# Altium project mach_do_nhiet_do_do_an_1.PrjPcb
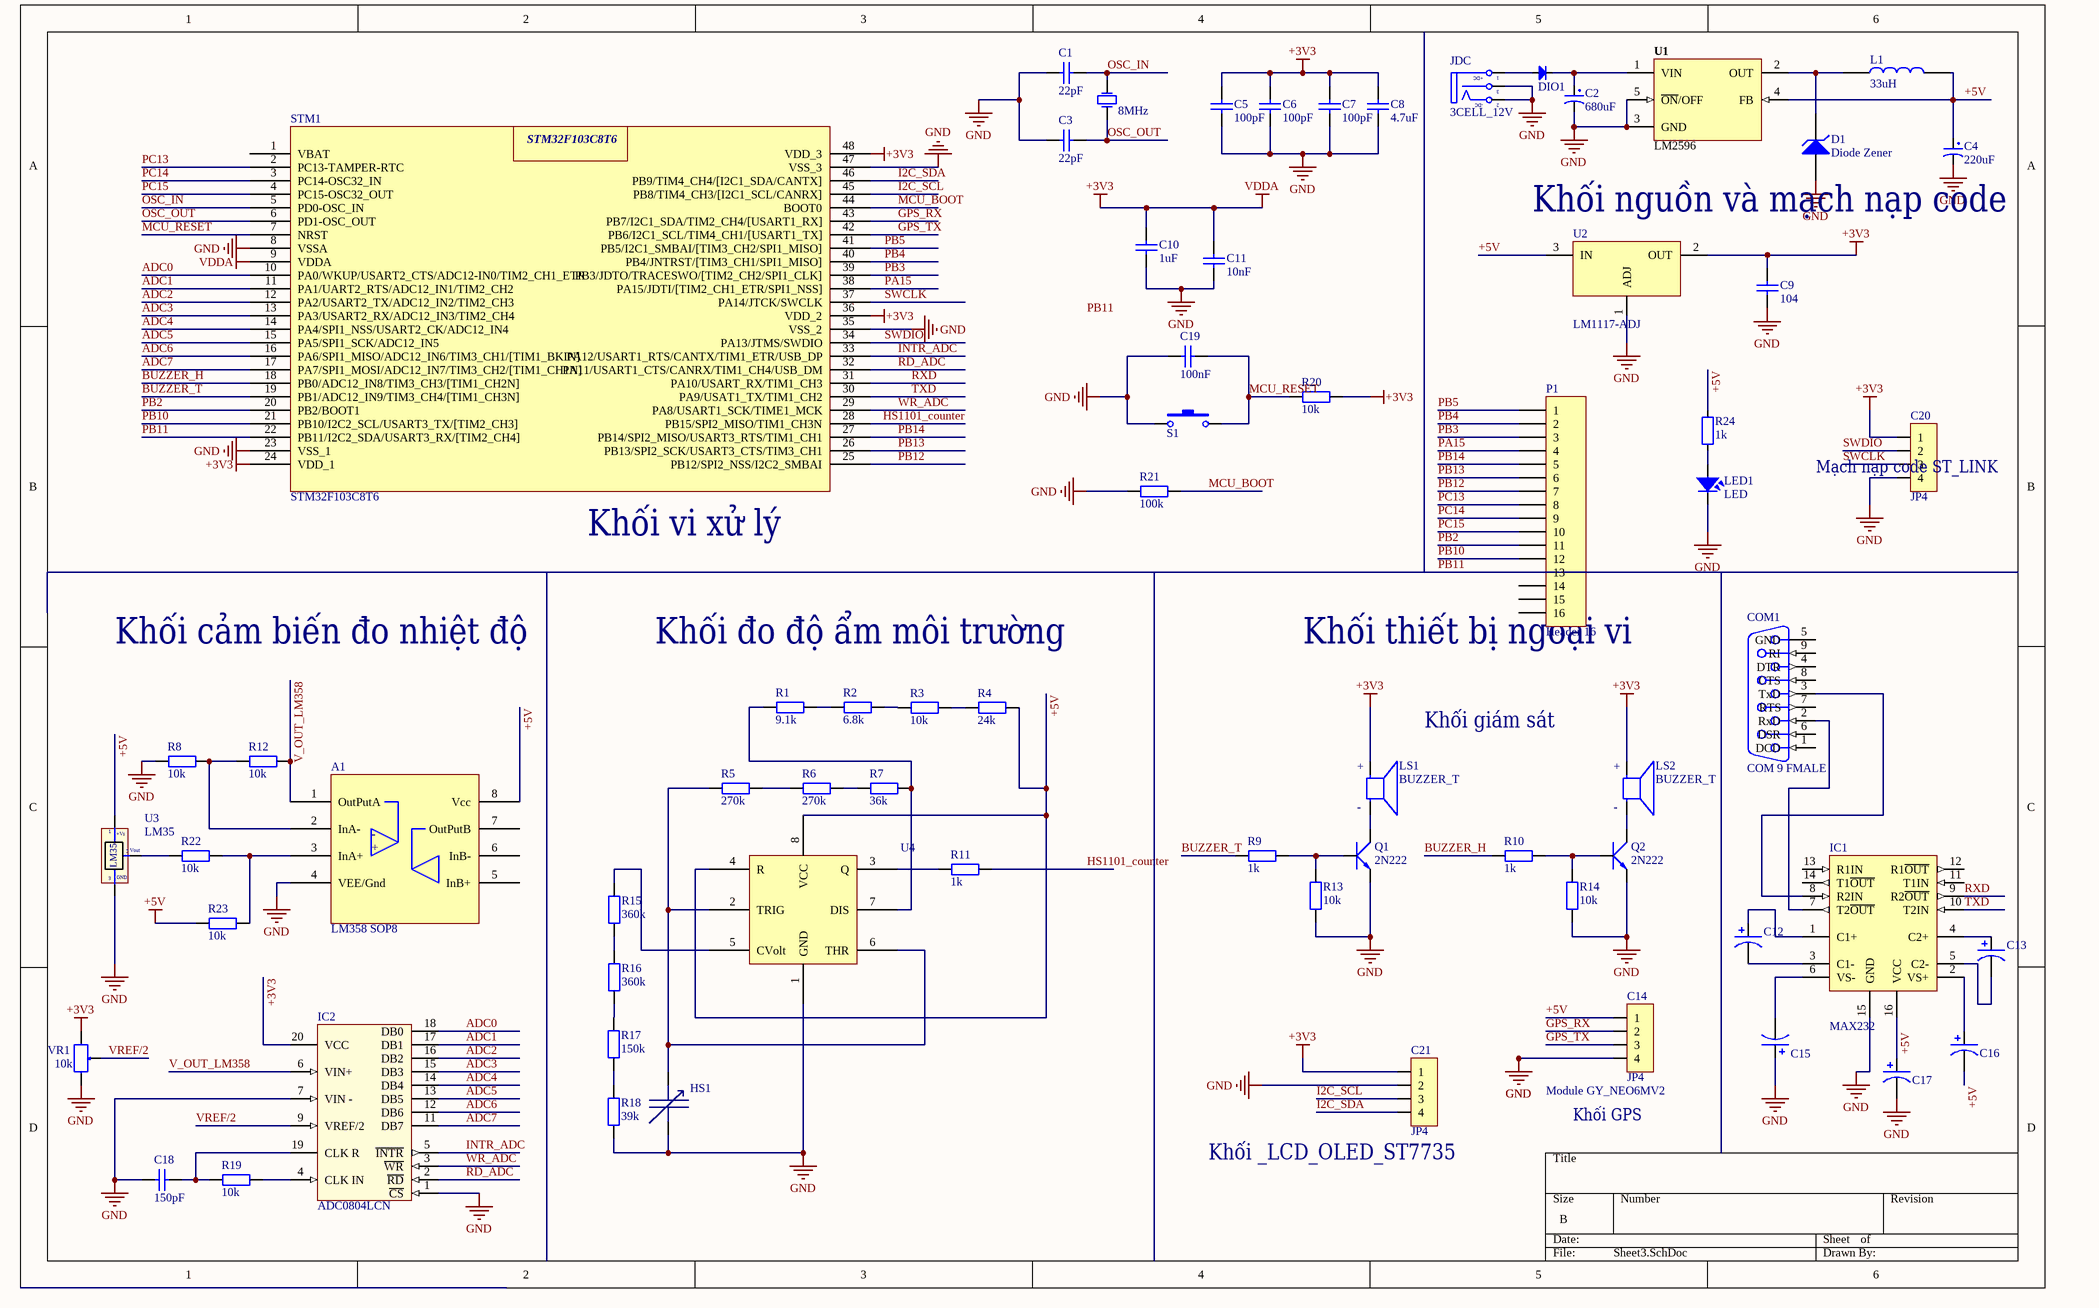
[diagram p0: Sheet3.SchDoc]
1 sheet, 68 parts. Net scope: global (net labels, ports and power ports of the same name join across sheets).
Board files: PCB1.PcbDoc, PCB2.PcbDoc

## Sheet Sheet3.SchDoc
size B

### Parts
A1  LM358 SOP8  [DIP8]
C1  22pF  [tu 0805]
C2  680uF  [tu hoa 13mm]
C3  22pF  [tu 0805]
C4  220uF  [Tu hoa 5mm]
C5  100pF  [Tu 0805]
C6  100pF  [Tu 0805]
C7  100pF  [Tu 0805]
C8  4.7uF  [Tu 0805]
C9  104  [tu 0805]
C10  1uF  [tu 0805]
C11  10nF  [tu 0805]
C12  10uF/50V  [C3MM]  (value not drawn)
C13  10uF/50V  [C3MM]  (value not drawn)
C14  JP4  [Header4]
C15  10uF/50V  [C3MM]  (value not drawn)
C16  10uF/50V  [C3MM]  (value not drawn)
C17  10uF/50V  [C3MM]  (value not drawn)
C18  150pF  [tu 0805]
C19  100nF  [tu 0805]
C20  JP4  [JP4-C1T]
C21  JP4  [Header4]
COM1  COM 9 FMALE  [COM9A]
D1  Diode Zener  [SMA]
DIO1  Diode SMD  [DIO-SMD-106]  (value not drawn)
HS1  C1815 SOT23 TRANS NPN 0.15A 50V (SMD-HF)  [Cam Bien HS1101]  (value not drawn)
IC1  MAX232  [DIP16/W0.3]
IC2  ADC0804LCN  [DIP20/W0.3]
JDC  3CELL_12V  [DC-IN]
L1  33uH  [Cuon Cam 7.5x7x5]
LED1  LED  [LED-0805-Red]
LS1  BUZZER_T  [XDCR_AI-1224-TWT-5V-R]
LS2  BUZZER_T  [XDCR_AI-1224-TWT-5V-R]
P1  Header 16  [HDR1X16]
Q1  2N222  [SOT23]
Q2  2N222  [SOT23]
R1  9.1k  [Tro SMD 0805]
R2  6.8k  [Tro SMD 0805]
R3  10k  [Tro SMD 0805]
R4  24k  [tro smd 0805]
R5  270k  [tro smd 0805]
R6  270k  [tro smd 0805]
R7  36k  [tro smd 0805]
R8  10k  [tro smd 0805]
R9  1k  [tro smd 0805]
R10  1k  [tro smd 0805]
R11  1k  [tro smd 0805]
R12  10k  [tro smd 0805]
R13  10k  [tro smd 0805]
R14  10k  [tro smd 0805]
R15  360k  [Tro SMD 0805]
R16  360k  [Tro SMD 0805]
R17  150k  [Tro SMD 0805]
R18  39k  [tro smd 0805]
R19  10k  [tro smd 0805]
R20  10k  [tro smd 0805]
R21  100k  [tro smd 0805]
R22  10k  [tro smd 0805]
R23  10k  [tro smd 0805]
R24  1k  [RES-SMD-0805]
S1  SW-SMD  [SW-SMD]  (value not drawn)
STM1  STM32F103C8T6  [QFP50P900X900X160-48N]
U1  LM2596  [TO263-5]
U2  LM1117-ADJ  [LM1117-SOP]
U3  LM35  [QTO-92]
U4  MH001514  [sop 8]  (value not drawn)
VR1  10k  [VAR_RESISTOR]
Y1  8MHz  [THACH ANH CAM]

### Nets
+3V3: C5.2 C6.2 C7.1 C8.1 C9.1 C10.1 C11.1 C20.1 C21.1 IC2.20(VCC) LS1.P LS2.P R20.1 STM1.9(VDDA) STM1.24(VDD_1) STM1.36(VDD_2) STM1.48(VDD_3) U2.2(OUT) VR1.1  [also labelled VDDA]
+5V: A1.8(Vcc) C4.1 C14.1 C16.2 C17.1 IC1.16(VCC) L1.2 R4.1 R23.1 R24.1 U1.4(FB) U2.3(IN) U3.1(+Vs) U4.4(R) U4.8(VCC)
GND: A1.4(VEE/Gnd) C1.2 C2.2 C3.2 C4.2 C5.1 C6.1 C7.2 C8.2 C9.2 C10.2 C11.2 C14.4 C15.1 C17.2 C18.2 C19.1 C20.4 C21.2 D1.1(A) HS1.1 IC1.15(GND) IC2.1(~{CS}) IC2.7(VIN_-) IC2.8(AGND) IC2.10(DGND) JDC.2(TN) JDC.3(S) LED1.2 Q1.1(E) Q2.1(E) R8.1 R13.1 R14.1 R18.1 R21.2 S1.1 STM1.8(VSSA) STM1.23(VSS_1) STM1.35(VSS_2) STM1.47(VSS_3) U1.3(GND) U1.5(~{ON}/OFF) U2.1(ADJ) U3.3(-) U4.1(GND) VR1.3
ADC0: IC2.18(DB0) STM1.10(PA0/WKUP/USART2_CTS/ADC12-IN0/TIM2_CH1_ETR)
ADC1: IC2.17(DB1) STM1.11(PA1/UART2_RTS/ADC12_IN1/TIM2_CH2)
ADC2: IC2.16(DB2) STM1.12(PA2/USART2_TX/ADC12_IN2/TIM2_CH3)
ADC3: IC2.15(DB3) STM1.13(PA3/USART2_RX/ADC12_IN3/TIM2_CH4)
ADC4: IC2.14(DB4) STM1.14(PA4/SPI1_NSS/USART2_CK/ADC12_IN4)
ADC5: IC2.13(DB5) STM1.15(PA5/SPI1_SCK/ADC12_IN5)
ADC6: IC2.12(DB6) STM1.16(PA6/SPI1_MISO/ADC12_IN6/TIM3_CH1/[TIM1_BKIN])
ADC7: IC2.11(DB7) STM1.17(PA7/SPI1_MOSI/ADC12_IN7/TIM3_CH2/[TIM1_CH1N])
BUZZER_H: R10.1 STM1.18(PB0/ADC12_IN8/TIM3_CH3/[TIM1_CH2N])
BUZZER_T: R9.1 STM1.19(PB1/ADC12_IN9/TIM3_CH4/[TIM1_CH3N])
GPS_RX: C14.2 STM1.43(PB7/I2C1_SDA/TIM2_CH4/[USART1_RX])
GPS_TX: C14.3 STM1.42(PB6/I2C1_SCL/TIM4_CH1/[USART1_TX])
HS1101_counter: R11.2 STM1.28(PB15/SPI2_MISO/TIM1_CH3N)
I2C_SCL: C21.3 STM1.45(PB8/TIM4_CH3/[I2C1_SCL/CANRX])
I2C_SDA: C21.4 STM1.46(PB9/TIM4_CH4/[I2C1_SDA/CANTX])
INTR_ADC: IC2.5(~{INTR}) STM1.33(PA12/USART1_RTS/CANTX/TIM1_ETR/USB_DP)
MCU_BOOT: R21.1 STM1.44(BOOT0)
MCU_RESET: C19.2 R20.2 S1.2 STM1.7(NRST)
OSC_IN: C1.1 STM1.5(PD0-OSC_IN) Y1.2(OSC2)
OSC_OUT: C3.1 STM1.6(PD1-OSC_OUT) Y1.1(OSC1)
PA15: P1.4 STM1.38(PA15/JDTI/[TIM2_CH1_ETR/SPI1_NSS])
PB2: P1.11 STM1.20(PB2/BOOT1)
PB3: P1.3 STM1.39(PB3/JDTO/TRACESWO/[TIM2_CH2/SPI1_CLK])
PB4: P1.2 STM1.40(PB4/JNTRST/[TIM3_CH1/SPI1_MISO])
PB5: P1.1 STM1.41(PB5/I2C1_SMBAI/[TIM3_CH2/SPI1_MISO])
PB10: P1.12 STM1.21(PB10/I2C2_SCL/USART3_TX/[TIM2_CH3])
PB11: P1.13 STM1.22(PB11/I2C2_SDA/USART3_RX/[TIM2_CH4])
PB12: P1.7 STM1.25(PB12/SPI2_NSS/I2C2_SMBAI)
PB13: P1.6 STM1.26(PB13/SPI2_SCK/USART3_CTS/TIM3_CH1)
PB14: P1.5 STM1.27(PB14/SPI2_MISO/USART3_RTS/TIM1_CH1)
PC13: P1.8 STM1.2(PC13-TAMPER-RTC)
PC14: P1.9 STM1.3(PC14-OSC32_IN)
PC15: P1.10 STM1.4(PC15-OSC32_OUT)
RD_ADC: IC2.2(~{RD}) STM1.32(PA11/USART1_CTS/CANRX/TIM1_CH4/USB_DM)
RXD: IC1.9(R2~{OUT}) STM1.31(PA10/USART_RX/TIM1_CH3)
SWCLK: C20.3 STM1.37(PA14/JTCK/SWCLK)
SWDIO: C20.2 STM1.34(PA13/JTMS/SWDIO)
TXD: IC1.10(T2IN) STM1.30(PA9/USAT1_TX/TIM1_CH2)
V_OUT_LM358: A1.1(OutPutA) IC2.6(VIN+) R12.2
VREF/2: IC2.9(VREF/2) VR1.2
WR_ADC: IC2.3(~{WR}) STM1.29(PA8/USART1_SCK/TIME1_MCK)
NetA1_2: A1.2(InA-) R8.2 R12.1
NetA1_3: A1.3(InA+) R22.2 R23.2
NetC2_1: C2.1 DIO1.2(K) U1.1(VIN)
NetC12_1: C12.1 IC1.1(C1+)
NetC12_2: C12.2 IC1.3(C1-)
NetC13_1: C13.1 IC1.4(C2+)
NetC13_2: C13.2 IC1.5(C2-)
NetC15_2: C15.2 IC1.6(VS-)
NetC16_1: C16.1 IC1.2(VS+)
NetC18_1: C18.1 IC2.19(CLK_R) R19.1
NetCOM1_2: COM1.2(RxD) IC1.7(T2~{OUT})
NetCOM1_3: COM1.3(TxD) IC1.8(R2IN)
NetD1_2: D1.2(K) L1.1 U1.2(OUT)
NetDIO1_1: DIO1.1(A) JDC.1(T)
NetHS1_2: HS1.2 R5.1 U4.2(TRIG) U4.6(THR)
NetIC2_4: IC2.4(CLK_IN) R19.2
NetLED1_1: LED1.1 R24.2
NetLS1_N: LS1.N Q1.3(C)
NetLS2_N: LS2.N Q2.3(C)
NetQ1_2: Q1.2(B) R9.2 R13.2
NetQ2_2: Q2.2(B) R10.2 R14.2
NetR1_1: R1.1 R2.2
NetR1_2: R1.2 R7.2 U4.7(DIS)
NetR2_1: R2.1 R3.2
NetR3_1: R3.1 R4.2
NetR5_2: R5.2 R6.1
NetR6_2: R6.2 R7.1
NetR11_1: R11.1 U4.3(Q)
NetR15_1: R15.1 R16.2
NetR15_2: R15.2 U4.5(CVolt)
NetR16_1: R16.1 R17.2
NetR17_1: R17.1 R18.2
NetR22_1: R22.1 U3.2(Vout)

Not connected (* = marked no-connect by the designer): A1 5(InB+) 6(InB-) 7(OutPutB); COM1 1(DCD) 4(DTR) 5(GND) 6(DSR) 7(RTS) 8(CTS) 9(RI) 10(MH1) 11(MH2); IC1 11(T1IN) 12(R1~{OUT}) 13(R1IN) 14(T1~{OUT}); P1 14 15 16; STM1 1(VBAT)

### Notes on the sheet
- Khối nguồn và mạch nạp code
- (near C20) Mạch nạp code ST_LINK
- (near STM1) Khối vi xử lý
- Khối cảm biến đo nhiệt độ
- Khối đo độ ẩm môi trường
- (near P1) Khối thiết bị ngoại vi
- Khối giám sát
- (near C14) Module GY_NEO6MV2
- (near C21) Khối _LCD_OLED_ST7735
- (near C14) Khối GPS
- Labels drawn without touching a wire or pin: PB11
- (in symbol AI-1224-TWT-5V-R) +; -
- (in symbol Jac_DC) +DC; -DC
- (in symbol LM35) GND
- (in symbol LM358) -; +

### Library data of the parts
A1 = LM358: Dán; Ma_Hang: MH000609; Don_Vi: Con; Ten_Linh_Kien: LM358 SOP8; Kieu_Chan: *; Ghi_Chu: *; Chung_Loai: Dán
C1 C3 = Tu 0805 22pF 50V 10%: Dán; Don_Vi: Con; So_Chan: 2; Ten_Linh_Kien: Tụ 0805 22P 10% 50V; Ma_Hang: MH004560; Chung_Loai: Dán; Kieu_Chan: *
C2 = Tu Hoa 680uF 25V 13x17: Cắm; Don_Vi: Con; So_Chan: 2; Ten_Linh_Kien: Tụ Hóa 680uF 25V; Ma_Hang: MH005082; Chung_Loai: Cắm; Kieu_Chan: *
C4 = Tu Hoa 220uF 16V 6x11: Cắm; Don_Vi: Con; So_Chan: 2; Ten_Linh_Kien: Tụ Hóa 220uF 16V 6x11MM; Ma_Hang: MH001348; Chung_Loai: Cắm; Kieu_Chan: *
C5-C8 = Tu 0805 200pF 50V 10%: Dán; Ten_Linh_Kien: Tụ 0805 200p 10% 50V; Don_Vi: Con; So_Chan: 2; Ma_Hang: MH008100; Chung_Loai: Dán; Kieu_Chan: *
C9 = Tu 0805 104 50V 10%: Dán; Don_Vi: Con; So_Chan: 2; Ten_Linh_Kien: Tụ 0805 104-100nF 10% 50V; Ma_Hang: MH004551; Chung_Loai: Dán; Kieu_Chan: *
C10 C11 C19 = Tu 0805 474 50V 10%: Dán; Don_Vi: Con; So_Chan: 2; Ten_Linh_Kien: Tụ 0805 474-470nF 50V 10%; Ma_Hang: MH006116; Chung_Loai: Dán; Kieu_Chan: *
C12 C13 C15-C17 = Cap Pol: Polarized Capacitor (Axial); Published: 8-Jun-2000; LatestRevisionDate: 17-Jul-2002; LatestRevisionNote: Re-released for DXP Platform.; PackageReference: POLAR0.8; Publisher: Altium Limited
C14 C20 C21 = JP4: WR-PHD 2.54 mm Angled Socket Header; Manufacturer: W¨¹rth Elektronik eiSos GmbH; partNo: 613004143121; ComponentLink1 Description: Manufacturer; ComponentLink2 Description: Datasheet; NoPins: 04; Created Date: 29 March 2013; ComponentLink1URL: http://www.we-online.com; ComponentLink2URL: http://katalog.we-online.de/em/datasheet/6130xx143121.pdf; Created by: Karrer Zheng
C18 = Tu 0805 220nF 50V 10%: Dán; Don_Vi: Con; So_Chan: 2; Ten_Linh_Kien: Tụ 0805 220nF 50V 10%; Ma_Hang: MH008099; Chung_Loai: Dán; Kieu_Chan: *
COM1 = COM9F: COM 9; PackageDocument: O; Positions: 9; Gender: Receptacle; Value: COM 9; Published: 15-Jun-2001; LatestRevisionDate: 17-Jul-2002; LatestRevisionNote: Re-released for DXP Platform.; DatasheetDocument: 1-Sep-1999; PackageReference: 788750; Publisher: Altium Limited; Orientation: Right Angle
D1 = Diode Zener: Zener Diode; Published: 8-Jun-2000; LatestRevisionDate: 17-Jul-2002; LatestRevisionNote: Re-released for DXP Platform.; PackageReference: DIODE-0.7; Publisher: Altium Limited
DIO1 = Diode SMD: Default Diode; Code - JEDEC: DO-214-AB; Value: 1N5007; Published: 8-Jun-2000; Revision: July-2002: Re-released for DXP Platform.; Publisher: Altium Limited
HS1 = Cam Bien HS1101: Cắm; Value: Cảm Biến Độ Ẩm HS1101
IC1 = MAX232: Dual EIA-232 Driver/Receiver; Value: MAX232
IC2 = ADC0804: Cắm; Ten_Linh_Kien: ADC0804LCN DIP20; Don_Vi: Con; Ma_Hang: MH002626; Ghi_Chu: *; Kieu_Chan: *; Chung_Loai: Cắm
JDC = Jac_DC: Cắm; Ten_Linh_Kien: Jack DC5.5x2.1MM DC5501; Ma_Hang: MH000923; Don_Vi: Con; Kieu_Chan: *; Ghi_Chu: *; Chung_Loai: Cắm
L1 = CUON CAM 47uH_ SMD: Dán; Don_Vi: Con; Ma_Hang: MH004211; Ten_Linh_Kien: Cuộn Cảm 47uH 7x7x4MM CD74R; Ghi_Chu: *; Kieu_Chan: *; Chung_Loai: Dán
LED1 = LED: LED Single colour Green and Red; Value: LED 3 ly Single Colour
LS1 LS2 = AI-1224-TWT-5V-R: AUDIO INDICATOR 5VDC 30MA 85DB; MF: PUI Audio, Inc.; MP: AI-1224-TWT-5V-R; SnapEDA_Link: https://www.snapeda.com/parts/AI-1224-TWT-5V-R/PUI%20Audio,%20Inc./view-part/5873694/?ref=snap; Availability: In Stock; Check_prices: https://www.snapeda.com/parts/AI-1224-TWT-5V-R/PUI%20Audio,%20Inc./view-part/5873694/?ref=eda; Value: *; Purchase-URL: https://pricing.snapeda.com/search/part/AI-1224-TWT-5V-R/?ref=eda; Package: PUI Audio, Inc.; Price: None
P1 = Header 16: Header, 16-Pin; LatestRevisionDate: 17-Jul-2002; LatestRevisionNote: Re-released for DXP Platform.; Publisher: Altium Limited
Q1 Q2 = 2N222: NPN 600mW, ECB; Value: C1815
R1-R3 R15-R17 = Tro 0805 5% 270k: Dán; Don_Vi: Con; So_Chan: 2; Ten_Linh_Kien: Trở 0805 5% 270k; Ma_Hang: MH005333; Chung_Loai: Dán; Kieu_Chan: *
R4 R18 = Tro 0805 5% 1M: Dán; Don_Vi: Con; So_Chan: 2; Ten_Linh_Kien: Trở 0805 5% 1M; Ma_Hang: MH005235; Chung_Loai: Dán; Kieu_Chan: *
R5-R7 = Tro 0805 1% 15k: Dán; Don_Vi: Con; So_Chan: 2; Ten_Linh_Kien: Trở 0805 1% 15k; Ma_Hang: MH005476; Chung_Loai: Dán; Kieu_Chan: *
R8 R12 R19 R22 R23 = Tro 0805 5% 10k: Dán; Don_Vi: Con; So_Chan: 2; Ten_Linh_Kien: Trở 0805 5% 10k; Ma_Hang: MH005239; Chung_Loai: Dán; Kieu_Chan: *
R9-R11 R20 R21 = Tro 0805 1% 1k: Dán; Don_Vi: Con; So_Chan: 2; Ten_Linh_Kien: Trở 0805 1% 1k; Ma_Hang: MH005468; Chung_Loai: Dán; Kieu_Chan: *
R13 R14 = Tro 0805 1% 10k: Dán; Don_Vi: Con; So_Chan: 2; Ten_Linh_Kien: Trở 0805 1% 10k; Ma_Hang: MH005473; Chung_Loai: Dán; Kieu_Chan: *
R24 = Resistor - SMD: Resistor; Manufacturer: Generic Components; Class: Passive; Published: 08/06/2000; Publisher: Altium Hobart Technology Centre
S1 = SW-SMD: Switch; Published: 24-Mar-1999; LatestRevisionDate: 17-Jul-2002; LatestRevisionNote: Re-released for DXP Platform.; PackageReference: SPST-2; Publisher: Altium Limited
STM1 = STM32F103C8T6: Dán; Ma_Hang: MH000567; Don_Vi: Con; Ten_Linh_Kien: STM32F103C8T6; Kieu_Chan: *; Ghi_Chu: *; Chung_Loai: Dán
U1 = LM2596: Max Input Voltage: 12 V; Max Output Current: 3 (6.0 peak) A; Max Output Voltage: mV; Category: IC-Power; Min Input Voltage: mV; Min Output Voltage: mV; Mounting Technology: Surface Mount; Status: Unreleased; Supply Voltage: mV; Temperature Range: -40 to +125 degC
U2 = LM1117-ADJ: 800mA Low-Dropout Linear Regulator; Creator: Nguyen Ba Bien; Website: http://group3i.net
U3 = LM35: Teminal; Value: LM35
U4 = NE555: Dán; Value: NE555 SOP8
VR1 = VR: Var Resistor; Value: VR 10K
Y1 = XTAL: Crystal Oscillator; Published: 8-Jun-2000; LatestRevisionDate: 17-Jul-2002; LatestRevisionNote: Re-released for DXP Platform.; PackageReference: R38; Publisher: Altium Limited